# Altium schematic sheet SUPPLY.SchDoc
size A3; SheetNumber: 2; SheetTotal: 2
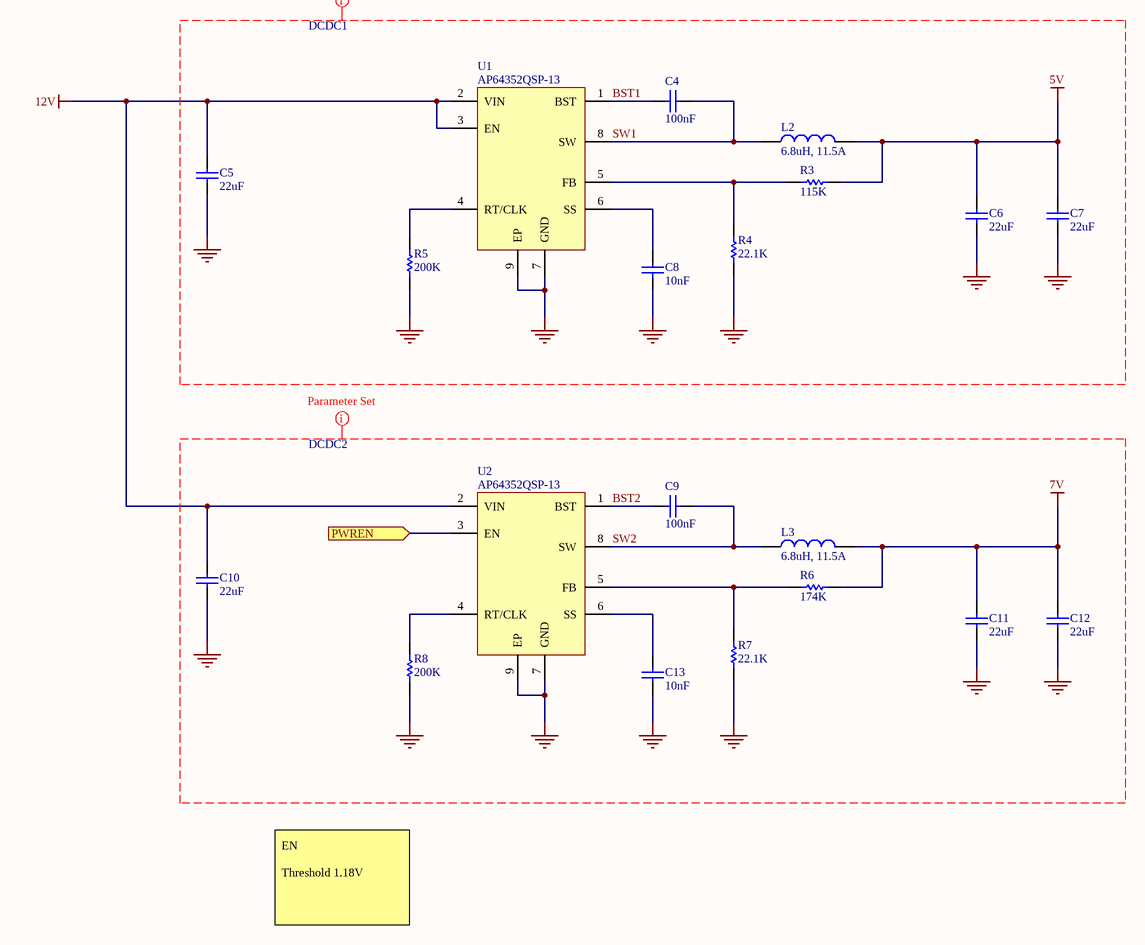
[diagram p0: SUPPLY.SchDoc]

## Parts
C4  value 100nF  [CAP_0603_H090 (_IPC_MD)]  (hidden comment: 100nF 0603)
C5  value 22uF  [CAP_1210_H090 (_IPC_HD)]  (hidden comment: 22uF 1210)
C6  value 22uF  [CAP_1210_H090 (_IPC_HD)]  (hidden comment: 22uF 1210)
C7  value 22uF  [CAP_1210_H090 (_IPC_HD)]  (hidden comment: 22uF 1210)
C8  value 10nF  [CAP_0603_H090 (_IPC_MD)]  (hidden comment: 10nF 0603)
C9  value 100nF  [CAP_0603_H090 (_IPC_MD)]  (hidden comment: 100nF 0603)
C10  value 22uF  [CAP_1210_H090 (_IPC_HD)]  (hidden comment: 22uF 1210)
C11  value 22uF  [CAP_1210_H090 (_IPC_HD)]  (hidden comment: 22uF 1210)
C12  value 22uF  [CAP_1210_H090 (_IPC_HD)]  (hidden comment: 22uF 1210)
C13  value 10nF  [CAP_0603_H090 (_IPC_MD)]  (hidden comment: 10nF 0603)
L2  6.8uH, 11.5A  [WE-HCC_1090]
L3  6.8uH, 11.5A  [WE-HCC_1090]
R3  value 115K  [RES_0603_H050 (_IPC_MD)]  (hidden comment: 115K 1% 0,1W 75V 0603)
R4  value 22.1K  [RES_0603_H050 (_IPC_MD)]  (hidden comment: 22.1K 1% 0,1W 75V 0603)
R5  value 200K  [RES_0603_H050 (_IPC_MD)]  (hidden comment: 200K 1% 0,1W 75V 0603)
R6  value 174K  [RES_0603_H050 (_IPC_MD)]  (hidden comment: 174K 1% 0,1W 75V 0603)
R7  value 22.1K  [RES_0603_H050 (_IPC_MD)]  (hidden comment: 22.1K 1% 0,1W 75V 0603)
R8  value 200K  [RES_0603_H050 (_IPC_MD)]  (hidden comment: 200K 1% 0,1W 75V 0603)
U1  AP64352QSP-13  [SOIC127P600X163-9N]
U2  AP64352QSP-13  [SOIC127P600X163-9N]

## Ports
PWREN (in)

## Nets
5V: C6.2 C7.2 L2.2 R3.2
7V: C11.2 C12.2 L3.2 R6.2
12V: C5.2 C10.2 U1.2(VIN) U1.3(EN) U2.2(VIN)
GND: C5.1 C6.1 C7.1 C8.1 C10.1 C11.1 C12.1 C13.1 R4.1 R5.1 R7.1 R8.1 U1.7(GND) U1.9(EP) U2.7(GND) U2.9(EP)
BST1: C4.2 U1.1(BST)
BST2: C9.2 U2.1(BST)
PWREN: U2.3(EN) ; port PWREN
SW1: C4.1 L2.1 U1.8(SW)
SW2: C9.1 L3.1 U2.8(SW)
NetC8_2: C8.2 U1.6(SS)
NetC13_2: C13.2 U2.6(SS)
NetR3_1: R3.1 R4.2 U1.5(FB)
NetR5_2: R5.2 U1.4(RT/CLK)
NetR6_1: R6.1 R7.2 U2.5(FB)
NetR8_2: R8.2 U2.4(RT/CLK)

## Layout directives
CompClassName: DCDC1: 5V, BST1, GND, SW1
CompClassName: DCDC2: 7V, BST2, GND, SW2

## Notes on the sheet
- EN
  Threshold 1.18V

## Library data of the parts
C4 C9 = CL10B104KB8NNNC: CAP CER 100NF 50V X7R 0603; Type: Standard; Designator: C?; PCB Lib: MUAB_CAP.PcbLib; Scm Lib: Discrete.SchLib; Tol: 10%; Volt: 50V; Part Number: CL10B104KB8NNNC; Dielec: X7R; Qty: 1; Supplier 1: Arrow; Supplier 2: Avnet; Supplier 3: Digi-Key; Supplier Part Number 3: 1276-1000-1-ND; Supplier 4: Distrelec; Supplier 5: Farnell; Supplier 6: Future Electronics; Supplier 7: Mouser; Supplier Part Number 7: 187-CL10B104KB8NNNC; Supplier 8: RSComponents; Supplier 9: Rutronik; Supplier 10: SEED OPL
C5-C7 C10-C12 = MA1210XR226K250ER: CAP CER 22UF 25V X7R 1210; Type: Standard; Designator: C?; PCB Lib: MUAB_CAP.PcbLib; Scm Lib: Discrete.SchLib; Tol: 10%; Volt: 25V; Part Number: MA1210XR226K250ER; Dielec: X7R; Qty: 1; Supplier 1: Arrow; Supplier 2: Avnet; Supplier 3: Digi-Key; Supplier 4: Distrelec; Supplier 5: Farnell; Supplier 6: Future Electronics; Supplier 7: Mouser; Supplier 8: RSComponents; Supplier 9: Rutronik; Supplier 10: SEED OPL
C8 C13 = CGA3E2C0G1H103J080AA: CAP CER 10NF 50V C0G/NP0 0603; Type: Standard; Designator: C?; PCB Lib: MUAB_CAP.PcbLib; Scm Lib: Discrete.SchLib; Dielec: C0G; Tol: 5%; Volt: 50V; Part Number: CGA3E2C0G1H103J080AA; Qty: 1; Supplier 1: Arrow; Supplier 2: Avnet; Supplier 3: Digi-Key; Supplier Part Number 3: 445-6916-1-ND; Supplier 4: Distrelec; Supplier 5: Farnell; Supplier 6: Future Electronics; Supplier 7: Mouser; Supplier Part Number 7: 810-CGA3E2C0G1H103J; Supplier 8: RSComponents; Supplier 9: Rutronik; Supplier 10: SEED OPL
L2 L3 = 7443330680: WE-HCC SMT High Current Cube Inductor, size 1090, 6.8uH, 11.5A; Manufacturer: Wurth Elektronik; Saturation Current: 11A; DC Resistance typ.: 14.15mOhm; DC Resistance max.: 15mOhm; Rated Inductance: 4.5uH; Material: Ferrite; Self Resonant Frequency: 40MHz; ComponentLink1Description: Manufacturer; ComponentLink1URL: http://www.we-online.de; ComponentLink2Description: Datasheet; ComponentLink2URL: https://www.we-online.com/catalog/datasheet/7443330680.pdf; Mounting Technology: SMT; Operating Temperature: -40 to +125degC; Packaging: Tape and Reel; Manufacturer Part Number: 7443330680; Rated Current: 11.5A; Inductance: 6.8uH; Size: 1090; Height: 9.3mm; Length: 10.9mm; Width: 10mm
R3 = RES115K1%0603: Designator: R; PCB Lib: MUAB_RES.PcbLib; Scm Lib: Discrete.SchLib; Watt: 0,1W; Tol: 1%; Part Number: RES115K1%0603; Type: Standard; Volt: 75V; Qty: 1; Supplier 1: Arrow; Supplier 2: Avnet; Supplier 3: Digi-Key; Supplier 4: Distrelec; Supplier 5: Farnell; Supplier 6: Future Electronics; Supplier 7: Mouser; Supplier 8: RSComponents; Supplier 9: Rutronik; Supplier 10: SEED OPL
R4 R7 = RES22.1K1%0603: Designator: R; PCB Lib: MUAB_RES.PcbLib; Scm Lib: Discrete.SchLib; Watt: 0,1W; Tol: 1%; Part Number: RES22.1K1%0603; Type: Standard; Volt: 75V; Qty: 1; Supplier 1: Arrow; Supplier 2: Avnet; Supplier 3: Digi-Key; Supplier 4: Distrelec; Supplier 5: Farnell; Supplier 6: Future Electronics; Supplier 7: Mouser; Supplier 8: RSComponents; Supplier 9: Rutronik; Supplier 10: SEED OPL
R5 R8 = RES200K1%0603: Designator: R; PCB Lib: MUAB_RES.PcbLib; Scm Lib: Discrete.SchLib; Watt: 0,1W; Tol: 1%; Part Number: RES200K1%0603; Type: Standard; Volt: 75V; Qty: 1; Supplier 1: Arrow; Supplier 2: Avnet; Supplier 3: Digi-Key; Supplier 4: Distrelec; Supplier 5: Farnell; Supplier 6: Future Electronics; Supplier 7: Mouser; Supplier 8: RSComponents; Supplier 9: Rutronik; Supplier 10: SEED OPL
R6 = RES174K1%0603: Designator: R; PCB Lib: MUAB_RES.PcbLib; Scm Lib: Discrete.SchLib; Watt: 0,1W; Tol: 1%; Part Number: RES174K1%0603; Type: Standard; Volt: 75V; Qty: 1; Supplier 1: Arrow; Supplier 2: Avnet; Supplier 3: Digi-Key; Supplier 4: Distrelec; Supplier 5: Farnell; Supplier 6: Future Electronics; Supplier 7: Mouser; Supplier 8: RSComponents; Supplier 9: Rutronik; Supplier 10: SEED OPL
U1 U2 = AP64352QSP-13: DCDC CONV HV BUCK SO-8EP T&R 4K; Designator: U; Volt: 3.8V to 40V; Volt Out: ADJ; Curr: 3.5A; Temp: I; Part Number: AP64352QSP-13; Component: AP64352; Type: Standard; Qty: 1; Supplier 1: Arrow; Supplier 2: Avnet; Supplier 3: Digi-Key; Supplier Part Number 3: 31-AP64352QSP-13CT-ND; Supplier 4: Distrelec; Supplier 5: Farnell; Supplier 6: Future Electronics; Supplier 7: Mouser; Supplier Part Number 7: 621-AP64352QSP-13; Supplier 8: RSComponents; Supplier 9: Rutronik; Supplier 10: TTI